# Altium schematic sheet 02.SchDoc
size 297 x 209 mm
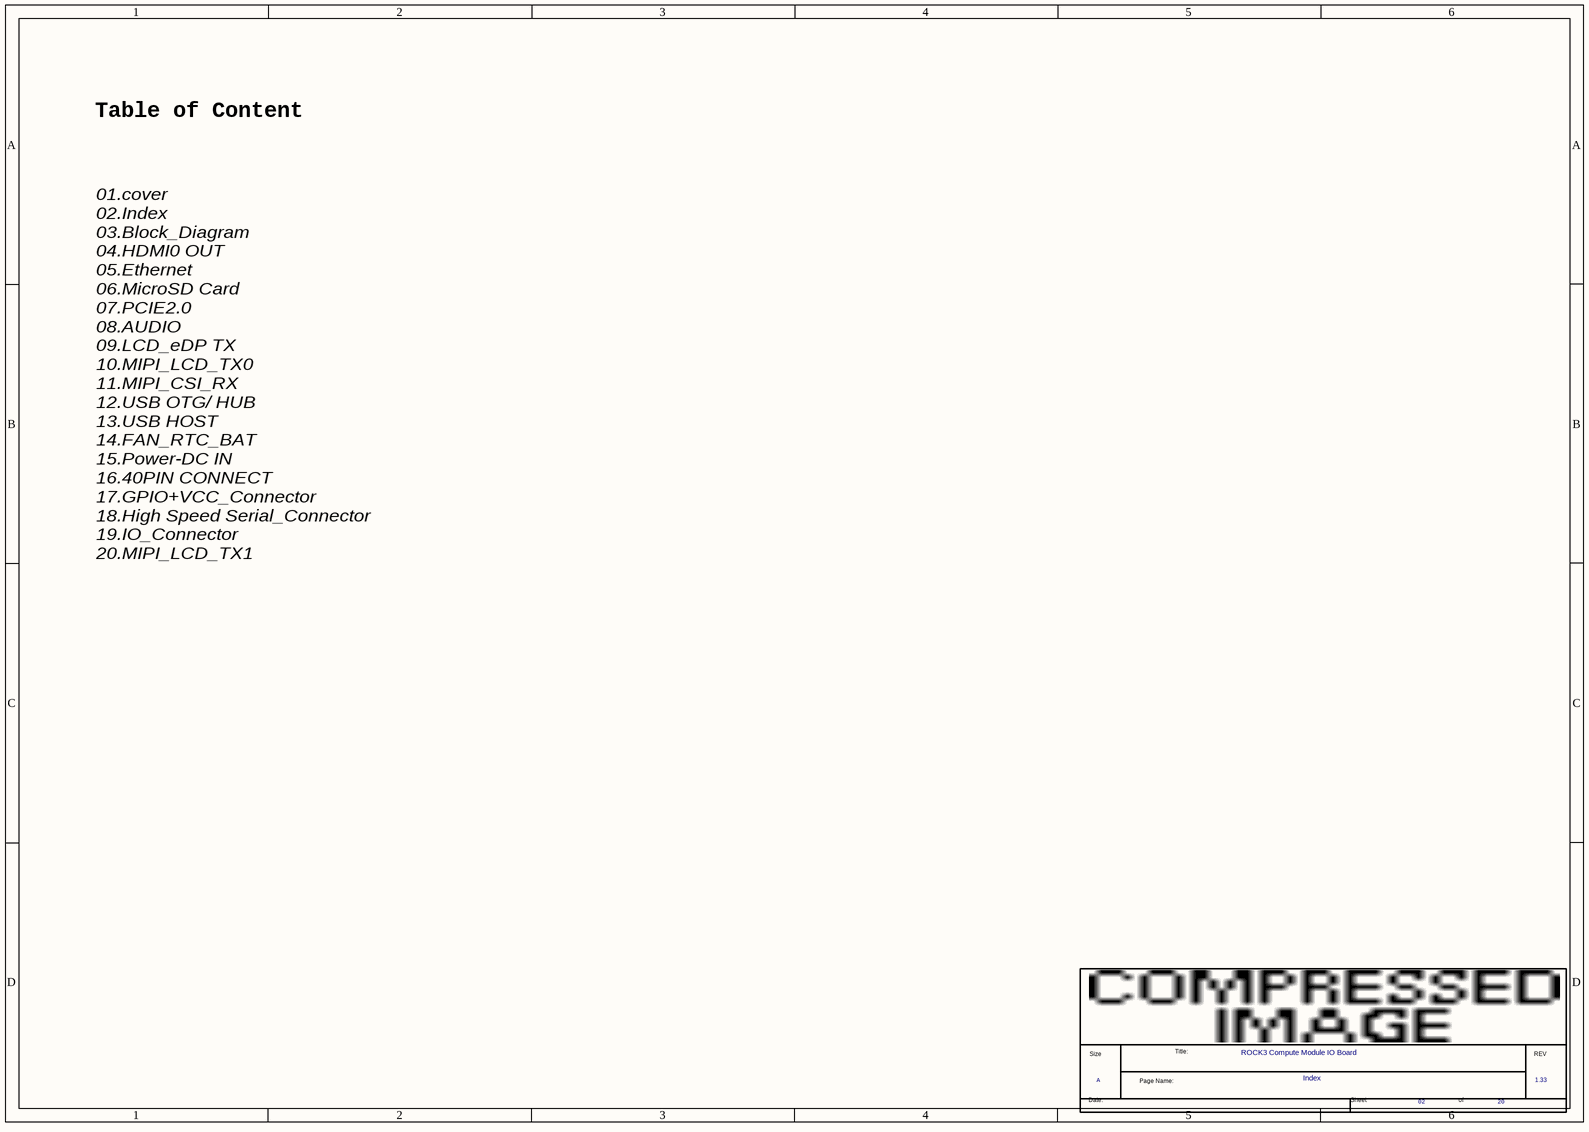
[diagram p0: 02.SchDoc]

## Parts
*  Page Count: 20  Page Number: 02  Page Size: A  Title: ROCK3 Compute Module IO Board  RevCode: 1.33  Doc: Index  (hidden comment: radxa_1010)  (graphical)

## Notes on the sheet
- Table of Content
- 01.cover
  02.Index
  03.Block_Diagram
  04.HDMI0 OUT
  05.Ethernet
  06.MicroSD Card
  07.PCIE2.0
  08.AUDIO
  09.LCD_eDP TX
  10.MIPI_LCD_TX0
  11.MIPI_CSI_RX
  12.USB OTG/ HUB
  13.USB HOST
  14.FAN_RTC_BAT
  15.Power-DC IN
  16.40PIN CONNECT
  17.GPIO+VCC_Connector
  18.High Speed Serial_Connector
  19.IO_Connector
  20.MIPI_LCD_TX1
- (in symbol radxa_1010) Title:; Size; REV; Page Name:; Date:; Sheet; of

## Library data of the parts
* = radxa_1010: Page Create Date: March  8, 1995